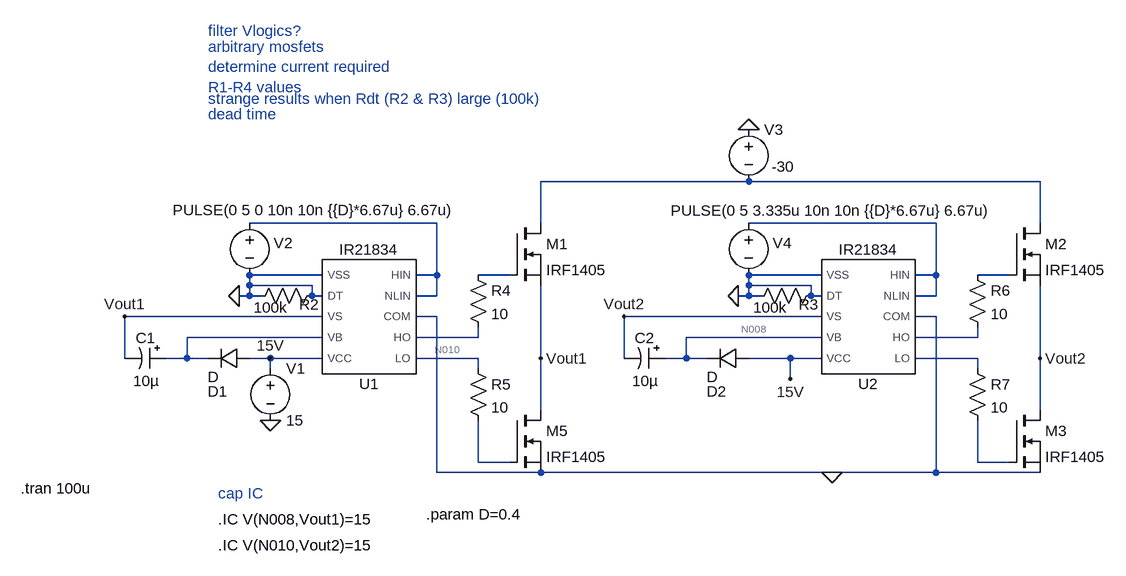
[diagram p0: schematic full_bridge_converter.asc]
full_bridge_converter.asc, the LTspice schematic file:
Version 4
SHEET 1 3256 968
WIRE 688 -272 368 -272
WIRE 1136 -272 688 -272
WIRE 208 -208 -80 -208
WIRE 368 -208 368 -272
WIRE 976 -208 688 -208
WIRE 1136 -208 1136 -272
WIRE 32 -128 -80 -128
WIRE 208 -128 208 -208
WIRE 208 -128 176 -128
WIRE 320 -128 272 -128
WIRE 800 -128 688 -128
WIRE 976 -128 976 -208
WIRE 976 -128 944 -128
WIRE 1088 -128 1040 -128
WIRE -80 -112 -80 -128
WIRE 16 -112 -80 -112
WIRE 688 -112 688 -128
WIRE 784 -112 688 -112
WIRE -80 -96 -80 -112
WIRE -80 -96 -96 -96
WIRE -64 -96 -80 -96
WIRE 16 -96 16 -112
WIRE 32 -96 16 -96
WIRE 208 -96 208 -128
WIRE 208 -96 176 -96
WIRE 688 -96 688 -112
WIRE 688 -96 672 -96
WIRE 704 -96 688 -96
WIRE 784 -96 784 -112
WIRE 800 -96 784 -96
WIRE 976 -96 976 -128
WIRE 976 -96 944 -96
WIRE 32 -64 -272 -64
WIRE 208 -64 176 -64
WIRE 800 -64 496 -64
WIRE 976 -64 944 -64
WIRE 32 -32 -176 -32
WIRE 272 -32 272 -48
WIRE 272 -32 176 -32
WIRE 800 -32 592 -32
WIRE 1040 -32 1040 -48
WIRE 1040 -32 944 -32
WIRE -272 0 -272 -64
WIRE -176 0 -176 -32
WIRE -176 0 -208 0
WIRE -144 0 -176 0
WIRE -48 0 -80 0
WIRE 32 0 -48 0
WIRE 272 0 176 0
WIRE 368 0 368 -112
WIRE 496 0 496 -64
WIRE 592 0 592 -32
WIRE 592 0 560 0
WIRE 624 0 592 0
WIRE 752 0 688 0
WIRE 800 0 752 0
WIRE 1040 0 944 0
WIRE 1136 0 1136 -112
WIRE -48 16 -48 0
WIRE 272 16 272 0
WIRE 1040 16 1040 0
WIRE 752 32 752 0
WIRE 368 80 368 0
WIRE 1136 80 1136 0
WIRE 272 160 272 96
WIRE 320 160 272 160
WIRE 1040 160 1040 96
WIRE 1088 160 1040 160
WIRE 208 176 208 -64
WIRE 368 176 208 176
WIRE 816 176 368 176
WIRE 976 176 976 -64
WIRE 976 176 816 176
WIRE 1136 176 976 176
FLAG 368 0 Vout1
FLAG 1136 0 Vout2
FLAG 816 176 0
FLAG -48 0 15V
FLAG -96 -96 0
FLAG -272 -64 Vout1
FLAG 752 32 15V
FLAG 672 -96 0
FLAG 496 -64 Vout2
FLAG 688 -352 0
FLAG -48 96 0
SYMBOL nmos 320 -208 R0
SYMATTR InstName M1
SYMATTR Value IRF1405
SYMBOL voltage -48 0 R0
WINDOW 123 0 0 Left 0
WINDOW 39 0 0 Left 0
SYMATTR InstName V1
SYMATTR Value 15
SYMBOL diode -80 -16 R90
WINDOW 0 83 49 VBottom 2
WINDOW 3 29 56 VTop 2
SYMATTR InstName D1
SYMBOL polcap -208 -16 R90
WINDOW 0 0 32 VBottom 2
WINDOW 3 35 31 VTop 2
SYMATTR InstName C1
SYMATTR Value 10µ
SYMBOL res 32 -112 R90
WINDOW 0 45 20 VBottom 2
WINDOW 3 18 79 VTop 2
SYMATTR InstName R2
SYMATTR Value 100k
SYMBOL voltage -80 -224 R0
WINDOW 0 37 47 Left 2
WINDOW 3 -118 -4 Left 2
WINDOW 123 0 0 Left 0
WINDOW 39 0 0 Left 0
SYMATTR InstName V2
SYMATTR Value PULSE(0 5 0 10n 10n {{D}*6.67u} 6.67u)
SYMBOL diode 688 -16 R90
WINDOW 0 83 49 VBottom 2
WINDOW 3 29 56 VTop 2
SYMATTR InstName D2
SYMBOL polcap 560 -16 R90
WINDOW 0 0 32 VBottom 2
WINDOW 3 35 31 VTop 2
SYMATTR InstName C2
SYMATTR Value 10µ
SYMBOL res 800 -112 R90
WINDOW 0 45 20 VBottom 2
WINDOW 3 18 79 VTop 2
SYMATTR InstName R3
SYMATTR Value 100k
SYMBOL voltage 688 -368 R0
WINDOW 3 35 73 Left 2
WINDOW 123 0 0 Left 0
WINDOW 39 0 0 Left 0
SYMATTR Value -30
SYMATTR InstName V3
SYMBOL res 256 -144 R0
SYMATTR InstName R4
SYMATTR Value 10
SYMBOL res 256 0 R0
SYMATTR InstName R5
SYMATTR Value 10
SYMBOL res 1024 -144 R0
SYMATTR InstName R6
SYMATTR Value 10
SYMBOL res 1024 0 R0
SYMATTR InstName R7
SYMATTR Value 10
SYMBOL nmos 320 80 R0
SYMATTR InstName M5
SYMATTR Value IRF1405
SYMBOL nmos 1088 -208 R0
SYMATTR InstName M2
SYMATTR Value IRF1405
SYMBOL nmos 1088 80 R0
SYMATTR InstName M3
SYMATTR Value IRF1405
SYMBOL voltage 688 -224 R0
WINDOW 0 37 47 Left 2
WINDOW 3 -120 -3 Left 2
WINDOW 123 0 0 Left 0
WINDOW 39 0 0 Left 0
SYMATTR InstName V4
SYMATTR Value PULSE(0 5 3.335u 10n 10n {{D}*6.67u} 6.67u)
SYMBOL AutoGenerated\\IR21834 112 -64 R180
SYMATTR InstName U1
SYMBOL AutoGenerated\\IR21834 880 -64 R180
SYMATTR InstName U2
TEXT -432 200 Left 2 !.tran 100u
TEXT -144 -376 Left 2 ;dead time
TEXT -144 -504 Left 2 ;filter Vlogics?
TEXT -128 248 Left 2 !.IC V(N008,Vout1)=15
TEXT -128 288 Left 2 !.IC V(N010,Vout2)=15
TEXT -128 208 Left 2 ;cap IC
TEXT -144 -480 Left 2 ;arbitrary mosfets\ndetermine current required\nR1-R4 values
TEXT 192 240 Left 2 !.param D=0.4
TEXT -144 -400 Left 2 ;strange results when Rdt (R2 & R3) large (100k)

The netlist it stands for:
* full_bridge_converter.asc
M1 N001 N004 Vout1 Vout1 IRF1405
V1 15V 0 15
D1 15V N006 D
C1 N006 Vout1 10µ
R2 0 0 100k
V2 N002 0 PULSE(0 5 0 10n 10n {{D}*6.67u} 6.67u)
D2 15V N008 D
C2 N008 Vout2 10µ
R3 0 0 100k
V3 0 N001 -30
R4 N004 N007 10
R5 N010 N012 10
R6 N005 N009 10
R7 N011 N013 10
M5 Vout1 N012 0 0 IRF1405
M2 N001 N005 Vout2 Vout2 IRF1405
M3 Vout2 N013 0 0 IRF1405
V4 N003 0 PULSE(0 5 3.335u 10n 10n {{D}*6.67u} 6.67u)
XU1 N010 N007 0 N002 N002 15V N006 Vout1 0 0 IR21834  ; pins LO HO COM NLIN HIN VCC VB VS DT VSS
XU2 N011 N009 0 N003 N003 15V N008 Vout2 0 0 IR21834  ; pins LO HO COM NLIN HIN VCC VB VS DT VSS
.model D D
.lib standard.dio
.model NMOS NMOS
.model PMOS PMOS
.lib standard.mos
.tran 100u
* dead time
* filter Vlogics?
.IC V(N008,Vout1)=15
.IC V(N010,Vout2)=15
* cap IC
* arbitrary mosfets
* determine current required
* R1-R4 values
.param D=0.4
* strange results when Rdt (R2 & R3) large (100k)
.lib C:\Users\5u3a1\Desktop\IR21834.lib
.backanno
.end